# EAGLE design usbbee-r1 (EAGLE 5.12)
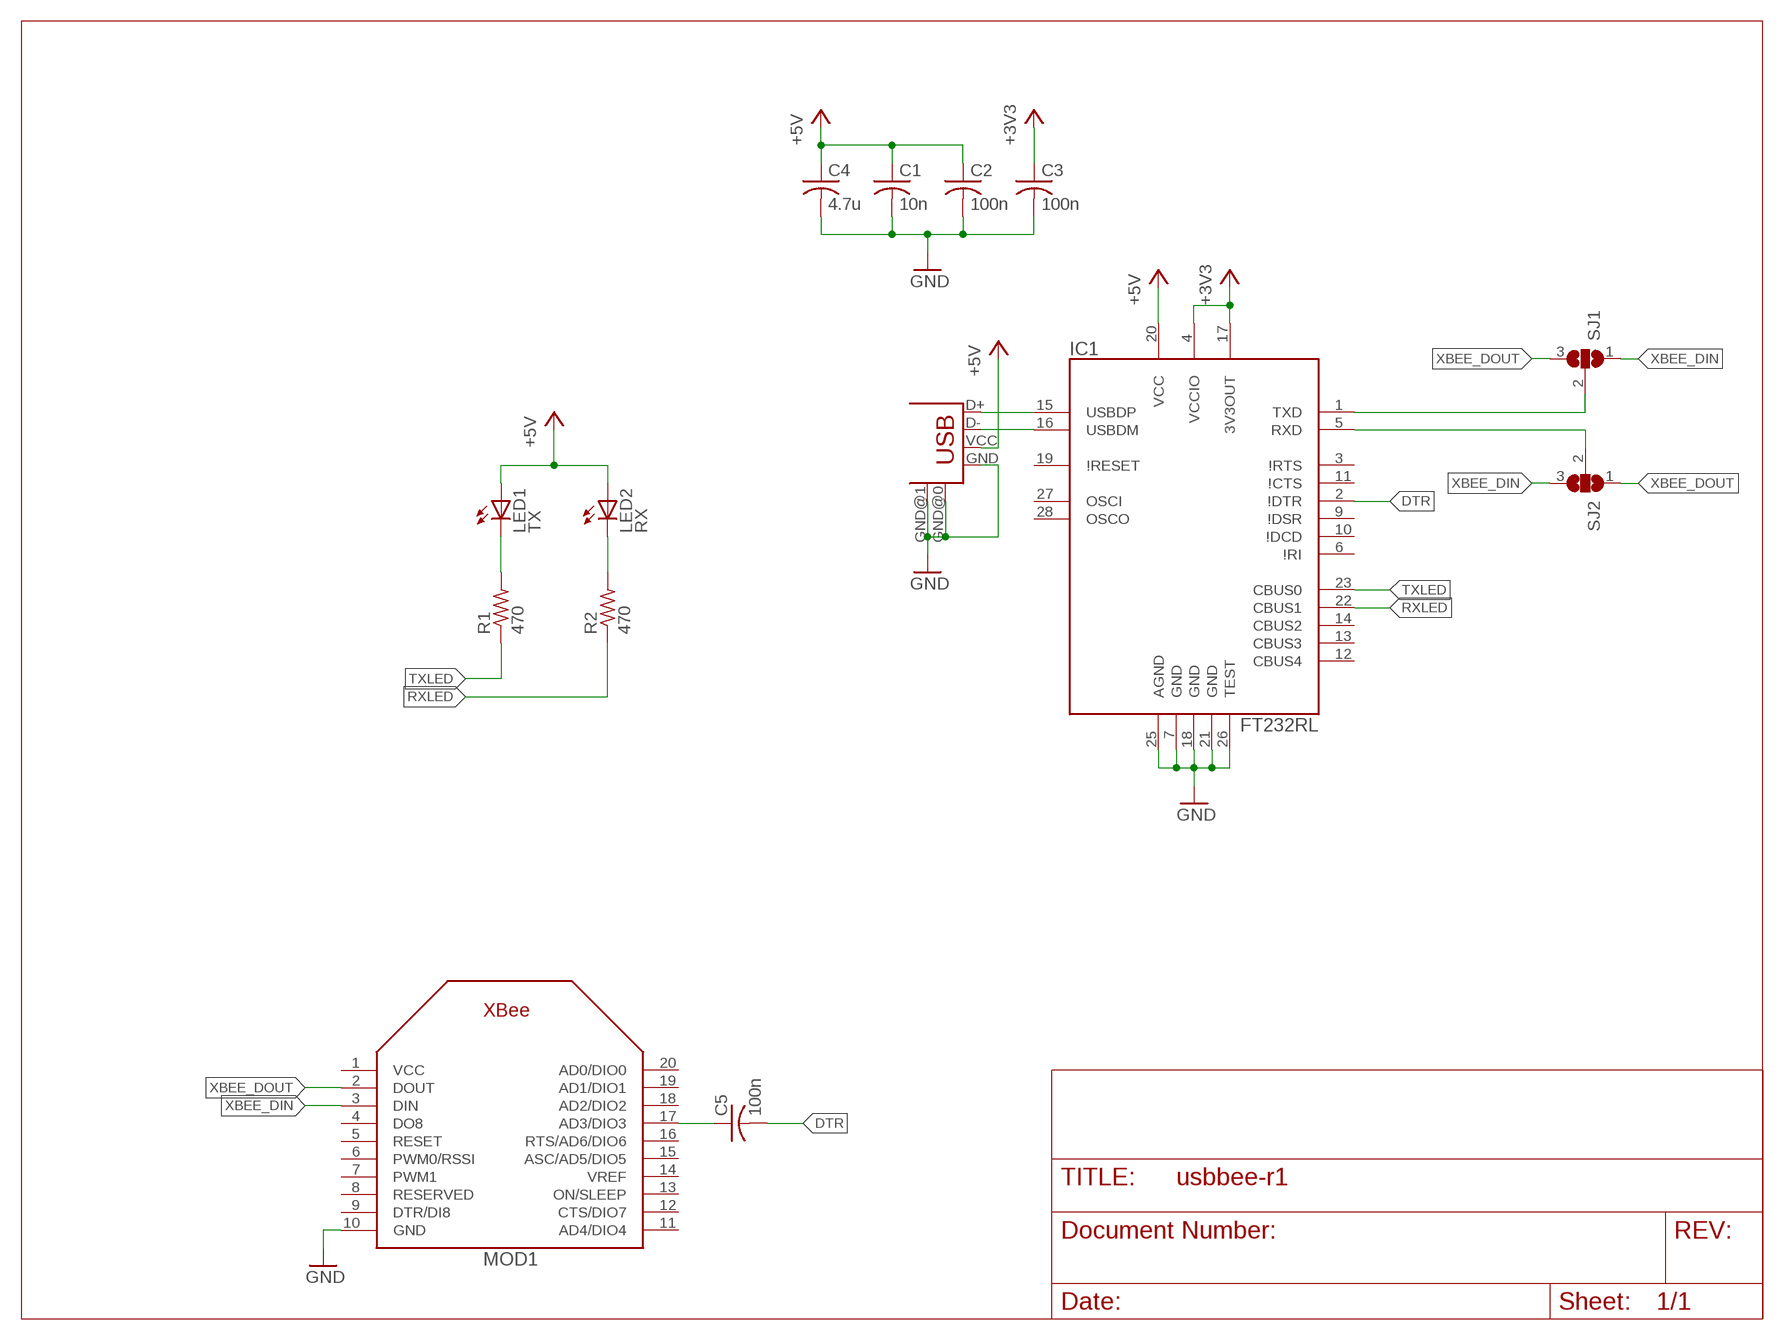
[diagram p0: schematic, sheet 1]

## Parts
C1  10n  C-USC0603  [C0603]
C2  100n  C-USC0603  [C0603]
C3  100n  C-USC0603  [C0603]
C4  4.7u  C-USC0805  [C0805]
C5  100n  C-USC0603  [C0603]
IC1  FT232RL  [SSOP-28-MFG]
LED1  TX  LEDCHIP-LED0603  [CHIP-LED0603]
LED2  RX  LEDCHIP-LED0603  [CHIP-LED0603]
MOD1  XBEE  [XBEE]
R1  470  R-US_R0603  [R0603]
R2  470  R-US_R0603  [R0603]
SJ1  SJ2W  [SJ_2]
SJ2  SJ2W  [SJ_2]
USB1  USB-U  [USB-MICROB-ALI]

## Nets
+3V3: C3.1 IC1.4(VCCIO) IC1.17(3V3OUT)
+5V: C1.1 C2.1 C4.1 IC1.20(VCC) LED1.A LED2.A USB1.VCC(VBUS)
DTR: C5.2 IC1.2(\!DTR)
GND: C1.2 C2.2 C3.2 C4.2 IC1.7(GND) IC1.18(GND) IC1.21(GND) IC1.25(AGND) IC1.26(TEST) MOD1.10(GND) USB1.GND USB1.GND@0(GND) USB1.GND@1(GND)
N$1: IC1.15(USBDP) USB1.D+
N$2: IC1.16(USBDM) USB1.D-
N$5: C5.1 MOD1.17(AD3/DIO3)
N$6: LED1.C R1.2
N$7: LED2.C R2.2
RXD: IC1.5(RXD) SJ2.2
RXLED: IC1.22(CBUS1) R2.1
TXD: IC1.1(TXD) SJ1.2
TXLED: IC1.23(CBUS0) R1.1
XBEE_DIN: MOD1.3(DIN) SJ1.1 SJ2.3
XBEE_DOUT: MOD1.2(DOUT) SJ1.3 SJ2.1
Unconnected: IC1.3(\!RTS) IC1.6(\!RI) IC1.9(\!DSR) IC1.10(\!DCD) IC1.11(\!CTS) IC1.12(CBUS4) IC1.13(CBUS3) IC1.14(CBUS2) IC1.19(\!RESET) IC1.27(OSCI) IC1.28(OSCO) MOD1.1(VCC) MOD1.4(DO8) MOD1.5(RESET) MOD1.6(PWM0/RSSI) MOD1.7(PWM1) MOD1.8(RESERVED) MOD1.9(DTR/DI8) MOD1.11(AD4/DIO4) MOD1.12(CTS/DIO7) MOD1.13(ON/SLEEP) MOD1.14(VREF) MOD1.15(ASC/AD5/DIO5) MOD1.16(RTS/AD6/DIO6) MOD1.18(AD2/DIO2) MOD1.19(AD1/DIO1) MOD1.20(AD0/DIO0)

## Library data of the parts
C1-C5 = rcl:C-US: CAPACITOR, American symbol
IC1 = rbg-ftdi-usb:FT232R
LED1 LED2 = led:LED: LED OSRAM: - CHIPLED LG R971, LG N971, LY N971, LG Q971, LY Q971, LO R971, LY R971 LH N974, LH R974 LS Q976, LO Q976, LY Q976 LO Q996 - Hyper CHIPLED LW Q18S LB Q993, LB Q99A, LB R99A - SideLED LS A670, LO A670, LY A670, LG A670, LP A670 LB A673, LV A673, LT A673, LW A673 LH A674 LY A675 LS A676, LA A676, LO A676, LY A676, LW A676 LS A679, LY A679, LG A679 - Hyper Micro SIDELED® LS Y876, LA Y876, LO Y876, LY Y876 LT Y87S - SmartLED LW L88C, LW L88S LB L89C, LB L89S, LG L890 LS L89K, LO L89K, LY L89K LS L896, LA L896, LO L896, LY L896 - TOPLED LS T670, LO T670, LY T670, LG T670, LP T670 LSG T670, LSP T670, LSY T670, LOP T670, LYG T670 LG T671, LOG T671, LSG T671 LB T673, LV T673, LT T673, LW T673 LH T674 LS T676, LA T676, LO T676, LY T676, LB T676, LH T676, LSB T676, LW T676 LB T67C, LV T67C, LT T67C, LS T67K, LO T67K, LY T67K, LW E67C LS E67B, LA E67B, LO E67B, LY E67B, LB E67C, LV E67C, LT E67C LW T67C LS T679, LY T679, LG T679 LS T770, LO T770, LY T770, LG T770, LP T770 LB T773, LV T773, LT T773, LW T773 LH T774 LS E675, LA E675, LY E675, LS T675 LS T776, LA T776, LO T776, LY T776, LB T776 LHGB T686 LT T68C, LB T68C - Hyper Mini TOPLED® LB M676 - Mini TOPLED Santana® LG M470 LS M47K, LO M47K, LY M47K Source: http://www.osram.convergy.de LUXEON: - LUMILED® LXK2-PW12-R00, LXK2-PW12-S00, LXK2-PW14-U00, LXK2-PW14-V00 LXK2-PM12-R00, LXK2-PM12-S00, LXK2-PM14-U00 LXK2-PE12-Q00, LXK2-PE12-R00, LXK2-PE12-S00, LXK2-PE14-T00, LXK2-PE14-U00 LXK2-PB12-K00, LXK2-PB12-L00, LXK2-PB12-M00, LXK2-PB14-N00, LXK2-PB14-P00, LXK2-PB14-Q00 LXK2-PR12-L00, LXK2-PR12-M00, LXK2-PR14-Q00, LXK2-PR14-R00 LXK2-PD12-Q00, LXK2-PD12-R00, LXK2-PD12-S00 LXK2-PH12-R00, LXK2-PH12-S00 LXK2-PL12-P00, LXK2-PL12-Q00, LXK2-PL12-R00 Source: www.luxeon.com KINGBRIGHT: KA-3528ASYC Source: www.kingbright.com
MOD1 = adafruit:XBEE
R1 R2 = rcl:R-US_: RESISTOR, American symbol
SJ1 SJ2 = jumper:SJ2W: SMD solder JUMPER
USB1 = con-usb-2:USB: USB Connectors

## Board
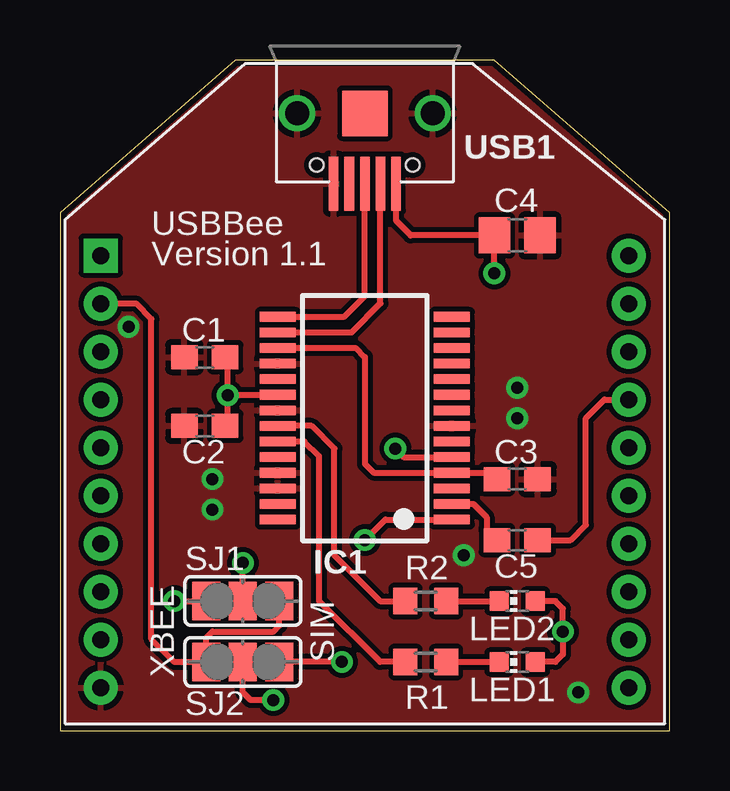
[diagram p1: board, top side]
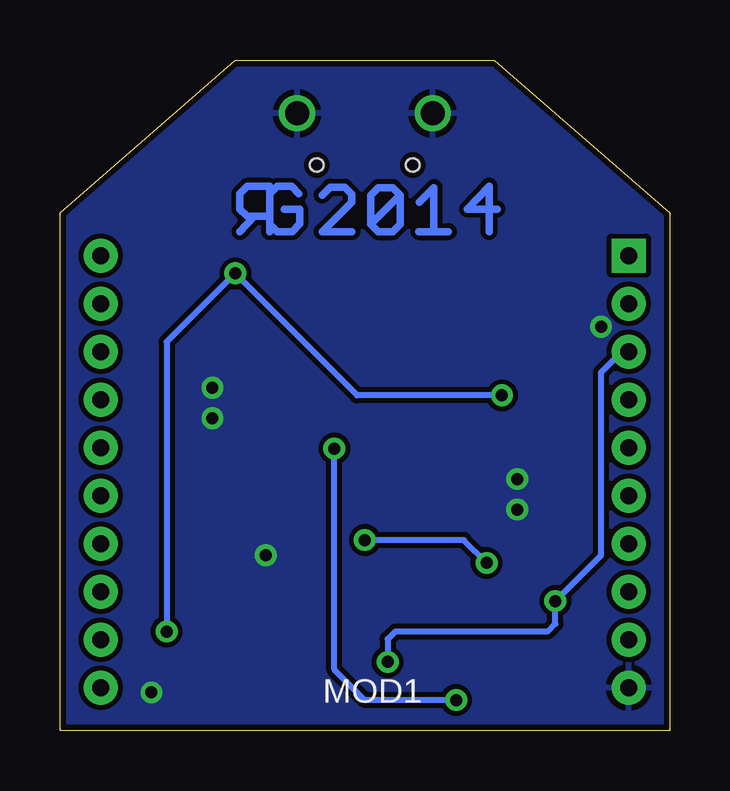
[diagram p2: board, bottom side, seen from below]

Size 25.4 x 27.94 mm. Coordinates in mm from the lower left corner, seen from the top.
Outline: 0,0 25.4,0 25.4,21.58 18.1,27.94 7.3,27.94 0,21.58 0,0
Copper layers (1*16): Top 0.035mm / dielectric 1.5mm / Bottom 0.035mm
Design rules "default *": minimum track width 8mil, minimum drill 0.5mm, track to track 8mil, track to pad 8mil, pad to pad 8mil, via to via 8mil, smd to smd 8mil, copper to edge 10mil, drill to drill 8mil, minimum pad ring 10mil, minimum via ring 8mil, stop-mask expansion 4mil, vias tented up to drill 0mil, thermal gap 10mil
tRestrict: 1 lines

### Footprints (pad centres in the part's own frame; a part is rotated, then mirrored left to right if it is on the bottom)
C0603 = smd 1.1 x 1: 1 -0.85,0; 2 0.85,0
C0805 = smd 1.3 x 1.5: 1 -0.95,0; 2 0.95,0
SSOP-28-MFG = smd 0.4 x 1.5: 1 -4.225,-3.625; 2 -3.575,-3.625; 3 -2.925,-3.625; 4 -2.275,-3.625; 5 -1.625,-3.625; 6 -0.975,-3.625; 7 -0.325,-3.625; 8 0.325,-3.625; 9 0.975,-3.625; 10 1.625,-3.625; 11 2.275,-3.625; 12 2.925,-3.625; 13 3.575,-3.625; 14 4.225,-3.625; 15 4.225,3.625; 16 3.575,3.625; 17 2.925,3.625; 18 2.275,3.625; 19 1.625,3.625; 20 0.975,3.625; 21 0.325,3.625; 22 -0.325,3.625; 23 -0.975,3.625; 24 -1.625,3.625; 25 -2.275,3.625; 26 -2.925,3.625; 27 -3.575,3.625; 28 -4.225,3.625
CHIP-LED0603 = smd 0.8 x 0.8: A 0,-0.75; C 0,0.75
XBEE = drill 0.7 pad 1.422 square: 1 -11,5.5 | drill 0.7 pad 1.422 round: 2 -11,3.5; 3 -11,1.5; 4 -11,-0.5; 5 -11,-2.5; 6 -11,-4.5; 7 -11,-6.5; 8 -11,-8.5; 9 -11,-10.5; 10 -11,-12.5; 11 11,-12.5; 12 11,-10.5; 13 11,-8.5; 14 11,-6.5; 15 11,-4.5; 16 11,-2.5; 17 11,-0.5; 18 11,1.5; 19 11,3.5; 20 11,5.5
R0603 = smd 1 x 1.1: 1 -0.85,0; 2 0.85,0
SJ_2 = smd 1.168 x 1.6: 1 -1.524,0; 2 0,0; 3 1.524,0
USB-MICROB-ALI = smd 0.4 x 2.25: D+ 0,2.925; D- -0.65,2.925; GND 1.3,2.925; ID 0.65,2.925; VCC -1.3,2.925 | drill 1 round: GND@0 -2.825,0; GND@1 2.825,0 | smd 1.9 x 1.9: GND@2 0,0 | hole 0.55: -2,2.15; 2,2.15

### Placement (x,y rotation side)
C1  6.03,15.56 180 top
C2  6.03,12.7 180 top
C3  19.05,10.48 0 top
C4  19.05,20.64 0 top
C5  19.05,7.94 180 top
IC1  12.7,13.02 90 top
LED1  19.05,2.86 90 top
LED2  19.05,5.4 90 top
MOD1  12.7,14.29 0 top
R1  15.24,2.86 0 top
R2  15.24,5.4 0 top
SJ1  7.62,5.4 0 top
SJ2  7.62,2.86 0 top
U$1  [RGLOGO_SMALL_2014]  16.51,20.64 0 bottom
USB1  12.7,25.72 180 top

### Tracks (layer width: path | path; a pad name or v marks a point on that pad's centre or on a via)
+3V3
  Top 0.254: C3.1 17.93,10.74 IC1.4 13.07,10.74 12.7,11.11 12.7,15.56 12.31,15.94 IC1.17
+5V  (via drill 0.5)
  Top 0.254: v6.99,13.97 6.99,12.8 C2.1 | IC1.20 7.01,13.99 v6.99,13.97 | v6.99,13.97 6.99,15.46 C1.1 | USB1.VCC 14,21.24 14.61,20.64 C4.1 v18.1,19.05 | LED1.A 20.64,2.86 20.95,3.17 v20.95,4.13 20.95,5.08 20.64,5.4 LED2.A
  Bottom 0.254: v20.95,4.13 20.95,16.19 v18.1,19.05 13.02,13.97 v6.99,13.97
DTR
  Top 0.254: IC1.2 17.23,9.44 17.78,8.89 17.78,8.36 C5.2
GND  (via drill 0.5)
  other vias: 21.59,1.59 19.05,13.02 19.05,14.29 6.35,10.48 6.35,9.21 2.86,16.83 16.83,7.3
  pour Bottom: -1.27,-0.95 26.67,-0.95 26.67,28.26 -1.27,28.26
  pour Top: -1.27,-0.95 26.67,-0.95 26.67,28.26 -1.27,28.26
N$1
  Top 0.254: USB1.D+ 12.7,18.1 11.85,17.24 IC1.15
N$2
  Top 0.254: USB1.D- 13.35,17.8 12.15,16.59 IC1.16
N$5
  Top 0.254: MOD1.17 22.68,13.79 21.91,13.02 21.91,8.57 21.27,7.94 C5.1
N$6
  Top 0.254: R1.2 LED1.C
N$7
  Top 0.254: R2.2 LED2.C
RXD  (via drill 0.5)
  Top 0.203: SJ2.2 8.89,2.86
  Top 0.254: IC1.5 14.32,11.39 v13.97,11.75 | v8.89,1.27 7.94,1.27 7.62,1.59 SJ2.2
  Bottom 0.254: v13.97,11.75 13.97,2.54 12.7,1.27 v8.89,1.27
RXLED
  Top 0.254: IC1.22 10.48,12.69 11.43,11.75 11.43,7.3 13.34,5.4 R2.1
TXD  (via drill 0.5)
  Top 0.203: SJ1.2 8.89,5.4
  Top 0.254: IC1.1 13.55,8.79 v12.7,7.94 | SJ1.2 v7.62,6.99
  Bottom 0.254: v12.7,7.94 8.57,7.94 v7.62,6.99
TXLED
  Top 0.254: IC1.23 10.18,12.04 10.79,11.43 10.79,5.4 13.34,2.86 R1.1
XBEE_DIN  (via drill 0.5)
  Top 0.254: v4.76,5.4 SJ1.1 | v11.75,2.86 SJ2.3
  Bottom 0.254: v11.75,2.86 11.75,3.81 11.43,4.13 5.08,4.13 4.76,4.45 v4.76,5.4 2.86,7.3 2.86,14.92 1.99,15.79 MOD1.3
XBEE_DOUT
  Top 0.254: SJ1.3 9.14,4.38 8.89,4.13 6.35,4.13 6.1,3.87 SJ2.1 4.76,2.86 3.81,3.81 3.81,17.14 3.17,17.79 MOD1.2

### Text on the board
tNames: USBBee | Version 1.1 | SIM | XBEE